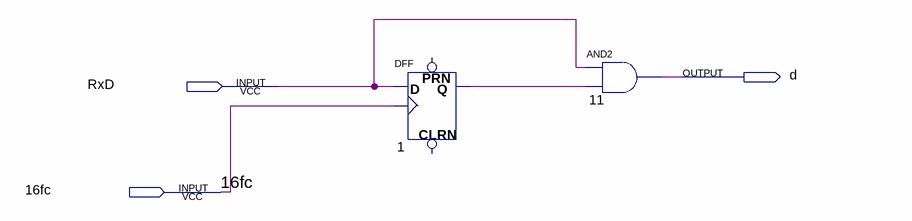
[diagram p0: schematic sheet]
// Quartus schematic sim1.bdf as structural Verilog: 2 symbols, 3 pins
module sim1 (
  input  RxD,
  input  \16fc ,
  output d
);

  wire n1_q;

  DFF u_1 (.CLK(\16fc ), .D(RxD), .Q(n1_q));  // open: CLRN, PRN
  and u_11 (d, RxD, n1_q);
endmodule
